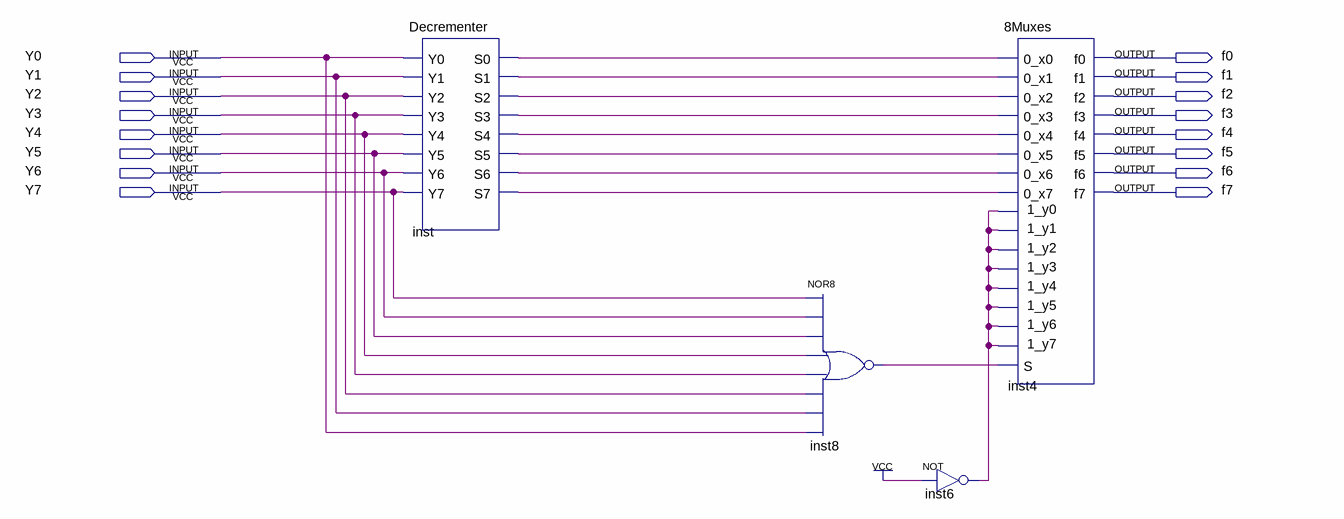
[diagram p0: schematic sheet]
// Quartus schematic Decrementer_NR.bdf as structural Verilog: 4 symbols, 16 pins
module Decrementer_NR (
  input  Y0,
  input  Y1,
  input  Y2,
  input  Y3,
  input  Y4,
  input  Y5,
  input  Y6,
  input  Y7,
  output f0,
  output f1,
  output f2,
  output f3,
  output f4,
  output f5,
  output f6,
  output f7
);

  wire inst6_out, inst8_out, inst_s0, inst_s1, inst_s2, inst_s3, inst_s4, inst_s5, inst_s6, inst_s7;

  Decrementer inst (
    .Y0(Y0), .Y1(Y1), .Y2(Y2), .Y3(Y3), .Y4(Y4), .Y5(Y5), .Y6(Y6), .Y7(Y7), .S0(inst_s0), .S1(inst_s1),
    .S2(inst_s2), .S3(inst_s3), .S4(inst_s4), .S5(inst_s5), .S6(inst_s6), .S7(inst_s7));
  nor inst8 (inst8_out, Y7, Y6, Y5, Y4, Y3, Y2, Y1, Y0);
  not inst6 (inst6_out, 1'b1);
  \8Muxes  inst4 (
    .\0_x0 (inst_s0), .\1_y0 (inst6_out), .\0_x1 (inst_s1), .\1_y1 (inst6_out), .\0_x2 (inst_s2),
    .\1_y2 (inst6_out), .\0_x3 (inst_s3), .\1_y3 (inst6_out), .\0_x4 (inst_s4), .\1_y4 (inst6_out),
    .\0_x5 (inst_s5), .\1_y5 (inst6_out), .\0_x6 (inst_s6), .\1_y6 (inst6_out), .\0_x7 (inst_s7),
    .S(inst8_out), .\1_y7 (inst6_out), .f0(f0), .f1(f1), .f2(f2), .f3(f3), .f4(f4), .f5(f5), .f6(f6), .f7(f7));
endmodule
